# Altium schematic sheet 1010829PA_HVFlyback_GD_Testboard_Overview.SchDoc: Overview
size A4; CompanyName: drivetek ag; DrawnBy: NLE; Address1: industriestrasse 37; Address2: 2555 brügg; Address3: Switzerland; SheetNumber: 1; SheetTotal: 5
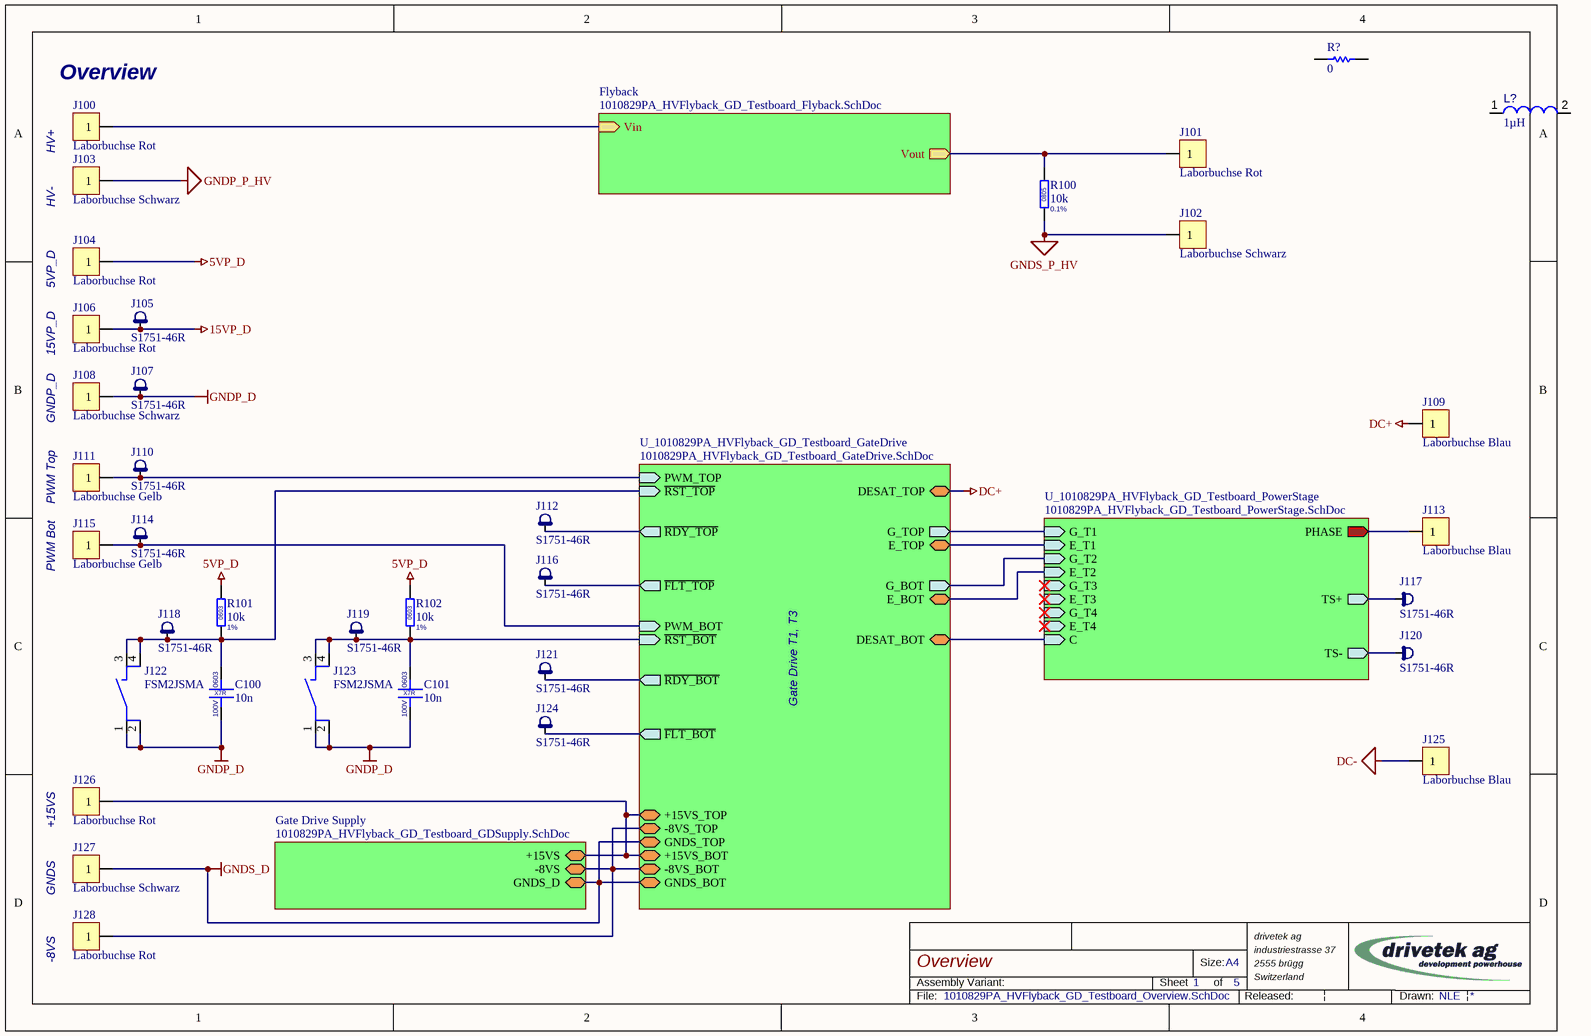
[diagram p0: 1010829PA_HVFlyback_GD_Testboard_Overview.SchDoc]

## Parts
C100  10n  CaseName: 0603  Type3: X7R  Voltage: 100V  [02_0603_DRK_1-7x1-0x0-9]
C101  10n  CaseName: 0603  Type3: X7R  Voltage: 100V  [02_0603_DRK_1-7x1-0x0-9]
J100  Laborbuchse Rot  [13_CON_DRK_DELTRON-571-0100-4mm-Buchse]
J101  Laborbuchse Rot  [13_CON_DRK_DELTRON-571-0100-4mm-Buchse]
J102  Laborbuchse Schwarz  [13_CON_DRK_DELTRON-571-0100-4mm-Buchse]
J103  Laborbuchse Schwarz  [13_CON_DRK_DELTRON-571-0100-4mm-Buchse]
J104  Laborbuchse Rot  [13_CON_DRK_DELTRON-571-0100-4mm-Buchse]
J105  S1751-46R  [13_PAD_DRK_HARWIN_S1751-46]
J106  Laborbuchse Rot  [13_CON_DRK_DELTRON-571-0100-4mm-Buchse]
J107  S1751-46R  [13_PAD_DRK_HARWIN_S1751-46]
J108  Laborbuchse Schwarz  [13_CON_DRK_DELTRON-571-0100-4mm-Buchse]
J109  Laborbuchse Blau  [13_CON_DRK_DELTRON-571-0100-4mm-Buchse]
J110  S1751-46R  [13_PAD_DRK_HARWIN_S1751-46]
J111  Laborbuchse Gelb  [13_CON_DRK_DELTRON-571-0100-4mm-Buchse]
J112  S1751-46R  [13_PAD_DRK_HARWIN_S1751-46]
J113  Laborbuchse Blau  [13_CON_DRK_DELTRON-571-0100-4mm-Buchse]
J114  S1751-46R  [13_PAD_DRK_HARWIN_S1751-46]
J115  Laborbuchse Gelb  [13_CON_DRK_DELTRON-571-0100-4mm-Buchse]
J116  S1751-46R  [13_PAD_DRK_HARWIN_S1751-46]
J117  S1751-46R  [13_PAD_DRK_HARWIN_S1751-46]
J118  S1751-46R  [13_PAD_DRK_HARWIN_S1751-46]
J119  S1751-46R  [13_PAD_DRK_HARWIN_S1751-46]
J120  S1751-46R  [13_PAD_DRK_HARWIN_S1751-46]
J121  S1751-46R  [13_PAD_DRK_HARWIN_S1751-46]
J122  FSM2JSMA  [10_SW_DRK_TYCO-FSM2JSMA]
J123  FSM2JSMA  [10_SW_DRK_TYCO-FSM2JSMA]
J124  S1751-46R  [13_PAD_DRK_HARWIN_S1751-46]
J125  Laborbuchse Blau  [13_CON_DRK_DELTRON-571-0100-4mm-Buchse]
J126  Laborbuchse Rot  [13_CON_DRK_DELTRON-571-0100-4mm-Buchse]
J127  Laborbuchse Schwarz  [13_CON_DRK_DELTRON-571-0100-4mm-Buchse]
J128  Laborbuchse Rot  [13_CON_DRK_DELTRON-571-0100-4mm-Buchse]
L?  value 1µH  [INDR62-500-1100X850X1100]  (hidden comment: RL622-1R0K-RC)
R100  10k  Tolerance: 0.1%  CaseName: 0805  [01_0805_DRK_2-2x1-5x0-65]
R101  10k  Tolerance: 1%  CaseName: 0603  [01_0603_DRK_1-7x1-0x0-55]
R102  10k  Tolerance: 1%  CaseName: 0603  [01_0603_DRK_1-7x1-0x0-55]
R?  value 0  [RESC3116X70X50ML13T20]  (hidden comment: Resistor 0R +/- 0.05% 1206 250 mW)

## Sub-sheets
Flyback = 1010829PA_HVFlyback_GD_Testboard_Flyback.SchDoc: Vin (in), Vout (out)
Gate Drive Supply = 1010829PA_HVFlyback_GD_Testboard_GDSupply.SchDoc: -8VS (bidir), +15VS (bidir), GNDS_D (bidir)
U_1010829PA_HVFlyback_GD_Testboard_GateDrive = 1010829PA_HVFlyback_GD_Testboard_GateDrive.SchDoc: PWM_TOP (in), ~{RDY_TOP} (out), PWM_BOT (in), G_BOT (out), ~{FLT_TOP} (out), ~{FLT_BOT} (out), ~{RDY_BOT} (out), ~{RST_TOP} (in), ~{RST_BOT} (in), -8VS_BOT (bidir), +15VS_BOT (bidir), E_BOT (bidir), G_TOP (out), -8VS_TOP (bidir), +15VS_TOP (bidir), E_TOP (bidir), DESAT_TOP (bidir), DESAT_BOT (bidir), GNDS_BOT (bidir), GNDS_TOP (bidir)
U_1010829PA_HVFlyback_GD_Testboard_PowerStage = 1010829PA_HVFlyback_GD_Testboard_PowerStage.SchDoc: G_T1 (in), G_T2 (in), G_T3 (in), G_T4 (in), E_T1 (in), E_T2 (in), E_T4 (in), E_T3 (in), C (in), PHASE (out), TS+ (out), TS- (out)

## Nets
5VP_D: J104.1 R101.2 R102.2
15VP_D: J105.1 J106.1
DC+: J109.1 ; sheet U_1010829PA_HVFlyback_GD_Testboard_GateDrive/DESAT_TOP
DC-: J125.1
GNDP_D: C100.2 C101.2 J107.1 J108.1 J122.1 J122.2 J123.1 J123.2
GNDP_P_HV: J103.1
GNDS_D: J127.1 ; sheet Gate Drive Supply/GNDS_D, sheet U_1010829PA_HVFlyback_GD_Testboard_GateDrive/GNDS_BOT, sheet U_1010829PA_HVFlyback_GD_Testboard_GateDrive/GNDS_TOP
GNDS_P_HV: J102.1 R100.1
NetC100_1: C100.1 J118.1 J122.3 J122.4 R101.1 ; sheet U_1010829PA_HVFlyback_GD_Testboard_GateDrive/~{RST_TOP}
NetC101_1: C101.1 J119.1 J123.3 J123.4 R102.1 ; sheet U_1010829PA_HVFlyback_GD_Testboard_GateDrive/~{RST_BOT}
NetJ100_1: J100.1 ; sheet Flyback/Vin
NetJ101_1: J101.1 R100.2 ; sheet Flyback/Vout
NetJ110_1: J110.1 J111.1 ; sheet U_1010829PA_HVFlyback_GD_Testboard_GateDrive/PWM_TOP
NetJ112_1: J112.1 ; sheet U_1010829PA_HVFlyback_GD_Testboard_GateDrive/~{RDY_TOP}
NetJ113_1: J113.1 ; sheet U_1010829PA_HVFlyback_GD_Testboard_PowerStage/PHASE
NetJ114_1: J114.1 J115.1 ; sheet U_1010829PA_HVFlyback_GD_Testboard_GateDrive/PWM_BOT
NetJ116_1: J116.1 ; sheet U_1010829PA_HVFlyback_GD_Testboard_GateDrive/~{FLT_TOP}
NetJ117_1: J117.1 ; sheet U_1010829PA_HVFlyback_GD_Testboard_PowerStage/TS+
NetJ120_1: J120.1 ; sheet U_1010829PA_HVFlyback_GD_Testboard_PowerStage/TS-
NetJ121_1: J121.1 ; sheet U_1010829PA_HVFlyback_GD_Testboard_GateDrive/~{RDY_BOT}
NetJ124_1: J124.1 ; sheet U_1010829PA_HVFlyback_GD_Testboard_GateDrive/~{FLT_BOT}
NetJ126_1: J126.1 ; sheet Gate Drive Supply/+15VS, sheet U_1010829PA_HVFlyback_GD_Testboard_GateDrive/+15VS_BOT, sheet U_1010829PA_HVFlyback_GD_Testboard_GateDrive/+15VS_TOP
NetJ128_1: J128.1 ; sheet Gate Drive Supply/-8VS, sheet U_1010829PA_HVFlyback_GD_Testboard_GateDrive/-8VS_BOT, sheet U_1010829PA_HVFlyback_GD_Testboard_GateDrive/-8VS_TOP
(unnamed): sheet U_1010829PA_HVFlyback_GD_Testboard_GateDrive/G_BOT, sheet U_1010829PA_HVFlyback_GD_Testboard_PowerStage/G_T2
(unnamed): sheet U_1010829PA_HVFlyback_GD_Testboard_GateDrive/E_BOT, sheet U_1010829PA_HVFlyback_GD_Testboard_PowerStage/E_T2
(unnamed): sheet U_1010829PA_HVFlyback_GD_Testboard_GateDrive/G_TOP, sheet U_1010829PA_HVFlyback_GD_Testboard_PowerStage/G_T1
(unnamed): sheet U_1010829PA_HVFlyback_GD_Testboard_GateDrive/E_TOP, sheet U_1010829PA_HVFlyback_GD_Testboard_PowerStage/E_T1
(unnamed): sheet U_1010829PA_HVFlyback_GD_Testboard_GateDrive/DESAT_BOT, sheet U_1010829PA_HVFlyback_GD_Testboard_PowerStage/C

Not connected (* = marked no-connect by the designer): L? 1 2; R? 1 2

## Notes on the sheet
- (near J100) Overview
- HV+
- (near J103) HV-
- 5VP_D
- 15VP_D
- (near J108) GNDP_D
- PWM Top
- (near J115) PWM Bot
- Gate Drive T1, T3
- +15VS
- GNDS
- (near J128) -8VS
- Assembly Variant:
- Sheet
- Size:
- of
- A4
- File:
- Released:
- |
- Drawn:

## Library data of the parts
C100 C101 = 02-0313: Part Description: Ceramic 0603 10n 100V 10% X7R, AEC-Q200; Manufacturer 1: Murata; Manufacturer Part Number 1: GCM188R72A103KA37D; LatestRevision Note: Initial; Type1: CAP; Type2: Ceramic; Tolerance: 10; Order Number: 81-GCM188R72A103KA7D; Part Number: 02-0313; Author: RLE; PartValue: 10n; ROHS: True; ComponentLink1Description: Datasheet; ComponentLink1URL: http://psearch.murata.com/capacitor/product/GCM1885C1H100JA16%23.pdf; LatestRevision Date: 25.06.2014; Distributor: Mouser; Price: 0.1
J100 J101 J104 J106 J126 J128 = 13-0252: Part Description: 4mm Laborbuchse rot; Manufacturer 1: Deltron; Manufacturer Part Number 1: 571-0500; LatestRevision Note: Initial; Type1: CON; Type2: TH; Voltage: 250V; Current: 10A; Order Number: 164-6219; Part Number: 13-0252; Author: MFR; PartValue: Laborbuchse Rot; ROHS: True; ComponentLink1Description: Datasheet; ComponentLink1URL: http://www.dem-uk.com/deltron-components/Data/Product_Downloads/571-SERIES.pdf; LatestRevision Date: 12.04.2012; Distributor: Mouser; Price: 2.1
J102 J103 J108 J127 = 13-0253: Part Description: 4mm Laborbuchse schwarz; Manufacturer 1: Deltron; Manufacturer Part Number 1: 571-0100; LatestRevision Note: Initial; Type1: CON; Type2: TH; Voltage: 250V; Current: 10A; Order Number: 164-6218; Part Number: 13-0253; Author: MFR; PartValue: Laborbuchse Schwarz; ROHS: True; ComponentLink1Description: Datasheet; ComponentLink1URL: http://www.dem-uk.com/deltron-components/Data/Product_Downloads/571-SERIES.pdf; LatestRevision Date: 12.04.2012; Distributor: Mouser; Price: 2.1
J105 J107 J110 J112 J114 J116-J121 J124 = 13-0487: Probe Hook; Part Description: SMD Probe Hook 2mm HIGH, 3.45x1.85mm; Manufacturer 1: Harwin; LatestRevision Note: Initial; Type1: TP; Type2: SMD; Order Number: 952-1478-2-ND; Order Number 2: 855-S1751-46R; Part Number: 13-0487; Author: CSI; PartValue: S1751-46R; ROHS: True; ComponentLink1Description: Datasheet; ComponentLink1URL: https://cdn.harwin.com/pdfs/60page187.pdf; LatestRevision Date: 19.09.2016; Manufacturer Part Number 1: S1751-46R; Distributor: DigiKey; Price: 0.25; Distributor 2: Mouser
J109 J113 J125 = 13-0507: Part Description: 4mm Laborbuchse blau; Manufacturer 1: Deltron; Manufacturer Part Number 1: 571-0200; LatestRevision Note: Initial; Type1: CON; Type2: TH; Voltage: 250V; Current: 10A; Order Number: 164-7120; Part Number: 13-0507; Author: RLE; PartValue: Laborbuchse Blau; ROHS: True; ComponentLink1Description: Datasheet; ComponentLink1URL: http://www.dem-uk.com/deltron-components/Data/Product_Downloads/571-SERIES.pdf; LatestRevision Date: 14.11.2016; Distributor: Mouser; Price: 1.87
J111 J115 = 13-0506: Part Description: 4mm Laborbuchse gelb; Manufacturer 1: Deltron; Manufacturer Part Number 1: 571-0700; LatestRevision Note: Initial; Type1: CON; Type2: TH; Voltage: 250V; Current: 10A; Order Number: 164-7170; Part Number: 13-0506; Author: RLE; PartValue: Laborbuchse Gelb; ROHS: True; ComponentLink1Description: Datasheet; ComponentLink1URL: http://www.dem-uk.com/deltron-components/Data/Product_Downloads/571-SERIES.pdf; LatestRevision Date: 08.11.2016; Distributor: Mouser; Price: 1.81
J122 J123 = 10-0001: Part Description: SWITCH, SPNO TACT SMD; Manufacturer 1: Tyco; Manufacturer Part Number 1: 3-1437565-0; LatestRevision Note: Initial; Voltage: 24V; Order Number: 506-3-1437565-0; Order Number 2: 450-1757-1-ND; Part Number: 10-0001; Author: CBA; PartValue: FSM2JSMA; ROHS: True; ComponentLink1Description: Datasheet; ComponentLink1URL: http://www.te.com/commerce/DocumentDelivery/DDEController?Action=showdoc&DocId=Customer+Drawing%7F2-1437565-7%7FU2%7Fpdf%7FEnglish%7FENG_CD_2-1437565-7_U2.pdf%7F3-1437565-0; LatestRevision Date: 26.12.2006; Distributor: Mouser; Price: 0.4; Distributor 2: Digikey
L? = CMP-006-00015-4: Radial Inductor, 1 uH, +/- 10%, 10 A, -55 to 105 degC, 2-Pin THD, RoHS, Bulk; Manufacturer: Bourns; Core Material: Ferrite; Shielding: Unshielded; Current Rating: 10A; Self Resonant Frequency: 150MHz; Resistance: 0.013Ohm; Case/Package: Radial; RoHS Compliant: True; Package Description: 2-Pin Radial Lead, Dia 8.5 mm, Pitch 5 mm; Packaging: Bulk; Datasheet Version: Aug-10; Package Quantity: 100; Mounting Technology: TH; Max Operating Temperature: 105°C; Lead Pitch: 5mm; Package Reference: INDR62-500-1100X850X1100; Datasheet URL: http://www.bourns.com/docs/Product-Datasheets/rl622_series.pdf; Diameter: 8.5mm; Tolerance: 10%; Inductance Tolerance: 10%; Min Operating Temperature: -55°C
R100 = 01-0406: Part Description: 0805 10k 100V 0.1W 0.1%; Manufacturer 1: Tyco; Manufacturer Part Number 1: RN73C2A10KBTG; LatestRevision Note: Checked; Type1: RES; Type2: Thinfilm; Voltage: 100V; Power: 100m; Checked: HHU; Order Number: 1140912; Part Number: 01-0406; Author: CBA; PartValue: 10k; ROHS: True; ComponentLink1Description: Datasheet; ComponentLink1URL: http://www.farnell.com/datasheets/75215.pdf; LatestRevision Date: 28.11.2008; Distributor: Farnell; Price: 3.7
R101 R102 = 01-0004: Part Description: 0603 10k 50V 0.063W 1%; Manufacturer 1: Multicomp; Manufacturer Part Number 1: MC 0.063W 0603 1% 10K; LatestRevision Note: Checked; Type1: RES; Type2: Thickfilm; Voltage: 50V; Power: 63m; Checked: CBA; Order Number: 9330399; Part Number: 01-0004; Author: CBA; PartValue: 10k; ROHS: True; ComponentLink1Description: Datasheet; ComponentLink1URL: http://www.farnell.com/datasheets/90824.pdf; LatestRevision Date: 06.10.2006; Distributor: Farnell; Price: 0.055
R? = CMP-009-00008-4: Chip Resistor, 0 Ohm, 0.25 W, -55 to 155 degC, 1206 (3216 Metric); Voltage Rating: 200V; Power: 250mW; Tolerance: 0.05%; Max Operating Temperature: 155°C; RoHS Compliant: True; Min Operating Temperature: -55°C; Pins: 2; Case/Package: 1206; Mounting Technology: SM